# EAGLE schematic EEZ DIB AFE1 r1B5 (EAGLE 7.2.0)
2 x Hi-voltage, 2 x Hi-current
Assembly variants: Farnell, TME

## Sheet 1 of 5: AFE Ch#1 (Hi-voltage)
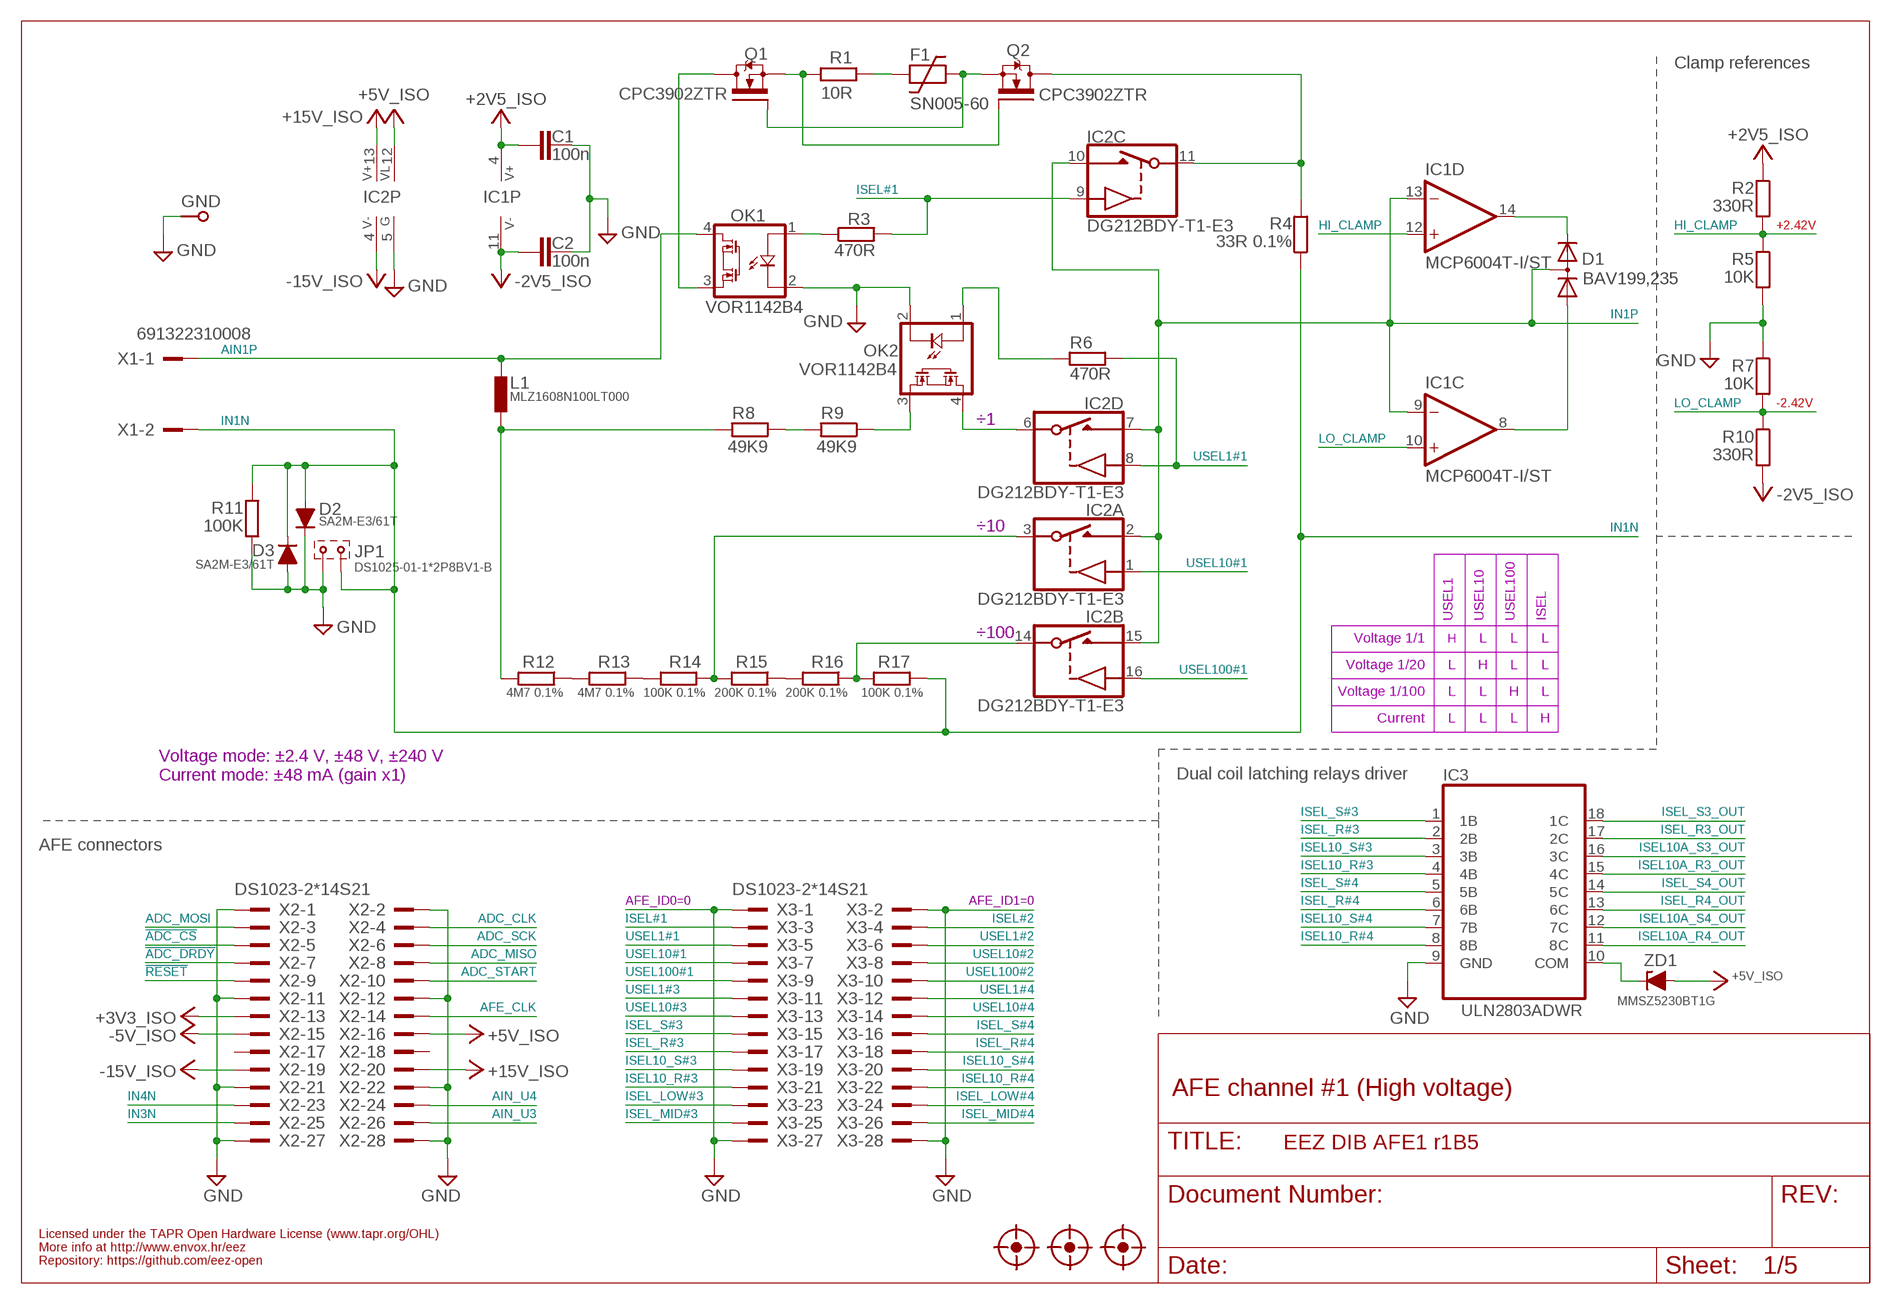
[diagram p0: schematic, sheet 1]

### Parts
C1  100n  C-EUC0603  [C0603]
C2  100n  C-EUC0603  [C0603]
D1  BAV199,235  BAV199  [SOT23]
D2  SA2M-E3/61T  DIODE_SMA-NARROW  [SMA_NARROW]
D3  SA2M-E3/61T  DIODE_SMA-NARROW  [SMA_NARROW]
F1  SN005-60  FUSE_RESETTABLE2  [C1206-HV]
FM1  FIDUCIAL_2  [FIDUCIAL_DUAL]
FM2  FIDUCIAL_2  [FIDUCIAL_DUAL]
FM3  FIDUCIAL_2  [FIDUCIAL_DUAL]
GND  PCB_TEST_TABSHIELD  [PCB_SHIELD_TAB]
IC1  MCP6004T-I/ST  OPA4197PW  [PW(R-PDSO-G14)]
IC2  DG212BDY-T1-E3  [SO16]
IC3  ULN2803ADWR  [DW18_TEX-M]
JP1  DS1025-01-1*2P8BV1-B  JUMPER-2PIN-2MM  [2MM-2]
L1  MLZ1608N100LT000  FERRITE_BEAD0603  [BEAD0603]
OK1  VOR1142B4  [DIL4-SMD]
OK2  VOR1142B4  [DIL4-SMD]
Q1  CPC3902ZTR  BSP129SOT-223  [SOT230P700X180-4N]
Q2  CPC3902ZTR  BSP129SOT-223  [SOT230P700X180-4N]
R1  10R  R-EU_R0805  [R0805]
R2  330R  R-EU_R0805  [R0805]
R3  470R  R-EU_R0805  [R0805]
R4  33R 0.1%  R-EU_R1206  [R1206]
R5  10K  R-EU_R0805  [R0805]
R6  470R  R-EU_R0805  [R0805]
R7  10K  R-EU_R0805  [R0805]
R8  49K9  R-EU_R1206  [R1206]
R9  49K9  R-EU_R1206  [R1206]
R10  330R  R-EU_R0805  [R0805]
R11  100K  R-EU_R1206  [R1206]
R12  4M7 0.1%  R-EU_R1206  [R1206]
R13  4M7 0.1%  R-EU_R1206  [R1206]
R14  100K 0.1%  R-EU_R1206  [R1206]
R15  200K 0.1%  R-EU_R1206  [R1206]
R16  200K 0.1%  R-EU_R1206  [R1206]
R17  100K 0.1%  R-EU_R1206  [R1206]
X1  691322310008  [691322310008]
X2  DS1023-2*14S21  TSW-114-07-F-D  [TSW-114-07-F-D]
X3  DS1023-2*14S21  TSW-114-07-F-D  [TSW-114-07-F-D]
ZD1  MMSZ5230BT1G  ZENER-DIODESOD123  [SOD123]

### Nets
!ADC_CS: X2.5 ; also sheet 5
!ADC_DRDY: X2.7 ; also sheet 5
!RESET: X2.9 ; also sheet 5
+2V5_ISO: C1.2 IC1.4(P:V+) R2.1 ; also sheet 3,4,5
+3V3_ISO: X2.13 ; also sheet 5
+5V_ISO: IC2.12(P:VL) X2.16 ZD1.A ; also sheet 2,3,4,5
+15V_ISO: IC2.13(P:V+) X2.20 ; also sheet 2,3,4
-2V5_ISO: C2.2 IC1.11(P:V-) R10.2 ; also sheet 3,4,5
-5V_ISO: X2.15 ; also sheet 5
-15V_ISO: IC2.4(P:V-) X2.19 ; also sheet 2,3,4
ADC_CLK: X2.4 ; also sheet 5
ADC_MISO: X2.8 ; also sheet 5
ADC_MOSI: X2.3 ; also sheet 5
ADC_SCK: X2.6 ; also sheet 5
ADC_START: X2.10 ; also sheet 5
AFE_CLK: X2.14
AIN1P: L1.P$2 OK1.4(S1) X1.1
AIN_U3: X2.26 ; also sheet 3
AIN_U4: X2.24 ; also sheet 4
CURR#1: IC2.11(C:S) Q2.2(D) Q2.4(D) R4.2
CURR_IN#1: OK1.3(S2) Q1.2(D) Q1.4(D)
GND: C1.1 C2.1 D2.1(C) D3.2(A) GND.1 IC2.5(P:GND) IC3.9(GND) JP1.2 OK1.2(C) OK2.2(C) R5.2 R7.1 R11.1 X2.1 X2.2 X2.11 X2.12 X2.21 X2.22 X2.27 X2.28 X3.1 X3.2 X3.27 X3.28 ; also sheet 2,3,4,5
HI_CLAMP: IC1.12(D:+IN) R2.2 R5.1 ; also sheet 2,3,4
IN1N: D2.2(A) D3.1(C) JP1.1 R4.1 R11.2 R17.1 X1.2 ; also sheet 5
IN1P: D1.3(AC) IC1.9(C:-IN) IC1.13(D:-IN) IC2.2(A:D) IC2.7(D:D) IC2.10(C:D) IC2.15(B:D) ; also sheet 5
IN3N: X2.25 ; also sheet 3,5
IN4N: X2.23 ; also sheet 4,5
ISEL10_R#3: IC3.4(4B) X3.21
ISEL10_R#4: IC3.8(8B) X3.22
ISEL10_S#3: IC3.3(3B) X3.19
ISEL10_S#4: IC3.7(7B) X3.20
ISEL10A_R3_OUT: IC3.15(4C) ; also sheet 3
ISEL10A_R4_OUT: IC3.11(8C) ; also sheet 4
ISEL10A_S3_OUT: IC3.16(3C) ; also sheet 3
ISEL10A_S4_OUT: IC3.12(7C) ; also sheet 4
ISEL#1: IC2.9(C:IN) R3.2 X3.3
ISEL#2: X3.4 ; also sheet 2
ISEL_LOW#3: X3.23 ; also sheet 3
ISEL_LOW#4: X3.24 ; also sheet 4
ISEL_MID#3: X3.25 ; also sheet 3
ISEL_MID#4: X3.26 ; also sheet 4
ISEL_R3_OUT: IC3.17(2C) ; also sheet 3
ISEL_R4_OUT: IC3.13(6C) ; also sheet 4
ISEL_R#3: IC3.2(2B) X3.17
ISEL_R#4: IC3.6(6B) X3.18
ISEL_S3_OUT: IC3.18(1C) ; also sheet 3
ISEL_S4_OUT: IC3.14(5C) ; also sheet 4
ISEL_S#3: IC3.1(1B) X3.15
ISEL_S#4: IC3.5(5B) X3.16
LO_CLAMP: IC1.10(C:+IN) R7.2 R10.1 ; also sheet 2,3,4
N$6: L1.P$1 R8.2 R12.2
N$44: OK2.1(A) R6.2
N$78: F1.2 Q1.1(G) Q2.3(S)
N$86: Q1.3(S) Q2.1(G) R1.2
N$128: R15.1 R16.2
N$137: IC3.10(COM) ZD1.C
N$139: OK1.1(A) R3.1
N$156: R13.1 R14.2
N$157: R12.1 R13.2
N$158: IC2.14(B:S) R16.1 R17.2
N$165: IC2.6(D:S) OK2.4(S1)
N$166: OK2.3(S2) R9.1
N$172: F1.1 R1.1
N$180: D1.2(C) IC1.14(D:OUT)
N$181: D1.1(A) IC1.8(C:OUT)
N$186: R8.1 R9.2
N$188: IC2.3(A:S) R14.1 R15.2
USEL1#1: IC2.8(D:IN) R6.1 X3.5
USEL1#2: X3.6 ; also sheet 2
USEL1#3: X3.11 ; also sheet 3
USEL1#4: X3.12 ; also sheet 4
USEL10#1: IC2.1(A:IN) X3.7
USEL10#2: X3.8 ; also sheet 2
USEL10#3: X3.13 ; also sheet 3
USEL10#4: X3.14 ; also sheet 4
USEL100#1: IC2.16(B:IN) X3.9
USEL100#2: X3.10 ; also sheet 2
Unconnected: X2.17 X2.18

### Notes on the sheet
- Clamp references
- +2.42V
- -2.42V
- ÷1
- ÷10
- USEL1 | USEL10 | USEL100 | ISEL
- ÷100
- Voltage 1/1 | H | L | L | L
- Voltage 1/20 | L | H | L | L
- Voltage 1/100 | L | L | H | L
- Current | L | L | L | H
- Dual coil latching relays driver
- Voltage mode: ±2.4 V, ±48 V, ±240 V
  Current mode: ±48 mA (gain x1)
- AFE connectors
- AFE_ID0=0 | AFE_ID1=0
- AFE channel #1 (High voltage)
- Licensed under the TAPR Open Hardware License (www.tapr.org/OHL)
- More info at http://www.envox.hr/eez
- Repository: https://github.com/eez-open

## Sheet 2 of 5: AFE Ch#2 (Hi-voltage)
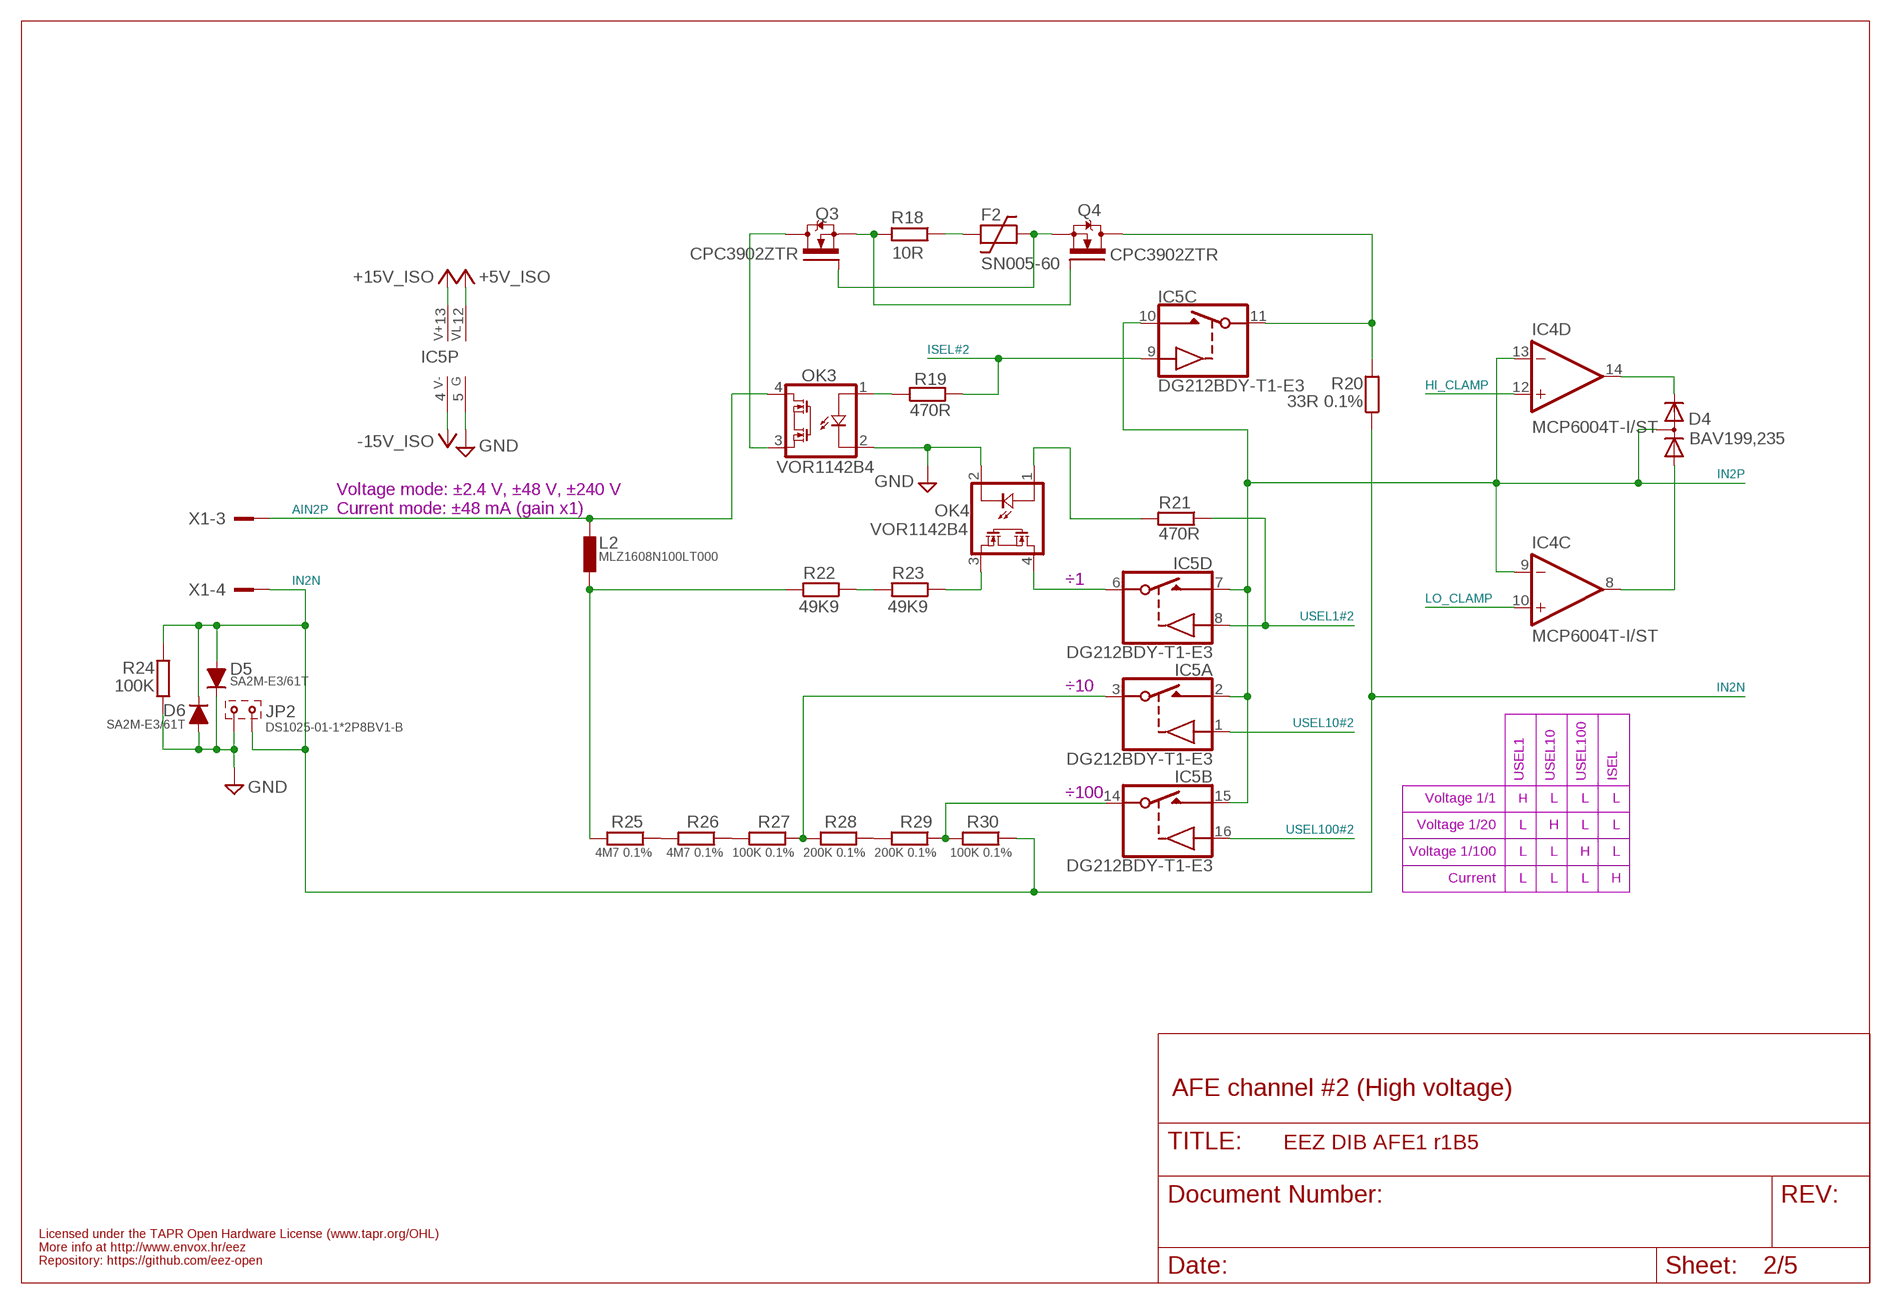
[diagram p1: schematic, sheet 2]

### Parts
D4  BAV199,235  BAV199  [SOT23]
D5  SA2M-E3/61T  DIODE_SMA-NARROW  [SMA_NARROW]
D6  SA2M-E3/61T  DIODE_SMA-NARROW  [SMA_NARROW]
F2  SN005-60  FUSE_RESETTABLE2  [C1206-HV]
IC4  MCP6004T-I/ST  OPA4197PW  [PW(R-PDSO-G14)]
IC5  DG212BDY-T1-E3  [SO16]
JP2  DS1025-01-1*2P8BV1-B  JUMPER-2PIN-2MM  [2MM-2]
L2  MLZ1608N100LT000  FERRITE_BEAD0603  [BEAD0603]
OK3  VOR1142B4  [DIL4-SMD]
OK4  VOR1142B4  [DIL4-SMD]
Q3  CPC3902ZTR  BSP129SOT-223  [SOT230P700X180-4N]
Q4  CPC3902ZTR  BSP129SOT-223  [SOT230P700X180-4N]
R18  10R  R-EU_R0805  [R0805]
R19  470R  R-EU_R0805  [R0805]
R20  33R 0.1%  R-EU_R1206  [R1206]
R21  470R  R-EU_R0805  [R0805]
R22  49K9  R-EU_R1206  [R1206]
R23  49K9  R-EU_R1206  [R1206]
R24  100K  R-EU_R1206  [R1206]
R25  4M7 0.1%  R-EU_R1206  [R1206]
R26  4M7 0.1%  R-EU_R1206  [R1206]
R27  100K 0.1%  R-EU_R1206  [R1206]
R28  200K 0.1%  R-EU_R1206  [R1206]
R29  200K 0.1%  R-EU_R1206  [R1206]
R30  100K 0.1%  R-EU_R1206  [R1206]

### Nets
+5V_ISO: IC5.12(P:VL) ; also sheet 1,3,4,5
+15V_ISO: IC5.13(P:V+) ; also sheet 1,3,4
-15V_ISO: IC5.4(P:V-) ; also sheet 1,3,4
AIN2P: L2.P$2 OK3.4(S1) X1.3
CURR#2: IC5.11(C:S) Q4.2(D) Q4.4(D) R20.2
CURR_IN#2: OK3.3(S2) Q3.2(D) Q3.4(D)
GND: D5.1(C) D6.2(A) IC5.5(P:GND) JP2.2 OK3.2(C) OK4.2(C) R24.1 ; also sheet 1,3,4,5
HI_CLAMP: IC4.12(D:+IN) ; also sheet 1,3,4
IN2N: D5.2(A) D6.1(C) JP2.1 R20.1 R24.2 R30.1 X1.4 ; also sheet 5
IN2P: D4.3(AC) IC4.9(C:-IN) IC4.13(D:-IN) IC5.2(A:D) IC5.7(D:D) IC5.10(C:D) IC5.15(B:D) ; also sheet 5
ISEL#2: IC5.9(C:IN) R19.2 ; also sheet 1
LO_CLAMP: IC4.10(C:+IN) ; also sheet 1,3,4
N$13: L2.P$1 R22.2 R25.2
N$56: IC5.14(B:S) R29.1 R30.2
N$57: IC5.6(D:S) OK4.4(S1)
N$58: OK4.3(S2) R23.1
N$59: D4.2(C) IC4.14(D:OUT)
N$60: D4.1(A) IC4.8(C:OUT)
N$61: R22.1 R23.2
N$62: IC5.3(A:S) R27.1 R28.2
N$63: R28.1 R29.2
N$64: R26.1 R27.2
N$65: R25.1 R26.2
N$66: OK3.1(A) R19.1
N$67: OK4.1(A) R21.2
N$68: F2.2 Q3.1(G) Q4.3(S)
N$69: Q3.3(S) Q4.1(G) R18.2
N$72: F2.1 R18.1
USEL1#2: IC5.8(D:IN) R21.1 ; also sheet 1
USEL10#2: IC5.1(A:IN) ; also sheet 1
USEL100#2: IC5.16(B:IN) ; also sheet 1

### Notes on the sheet
- Voltage mode: ±2.4 V, ±48 V, ±240 V
  Current mode: ±48 mA (gain x1)
- ÷1
- ÷10
- USEL1 | USEL10 | USEL100 | ISEL
- ÷100
- Voltage 1/1 | H | L | L | L
- Voltage 1/20 | L | H | L | L
- Voltage 1/100 | L | L | H | L
- Current | L | L | L | H
- AFE channel #2 (High voltage)
- Licensed under the TAPR Open Hardware License (www.tapr.org/OHL)
- More info at http://www.envox.hr/eez
- Repository: https://github.com/eez-open

## Sheet 3 of 5: AFE Ch#3 (Hi-current)
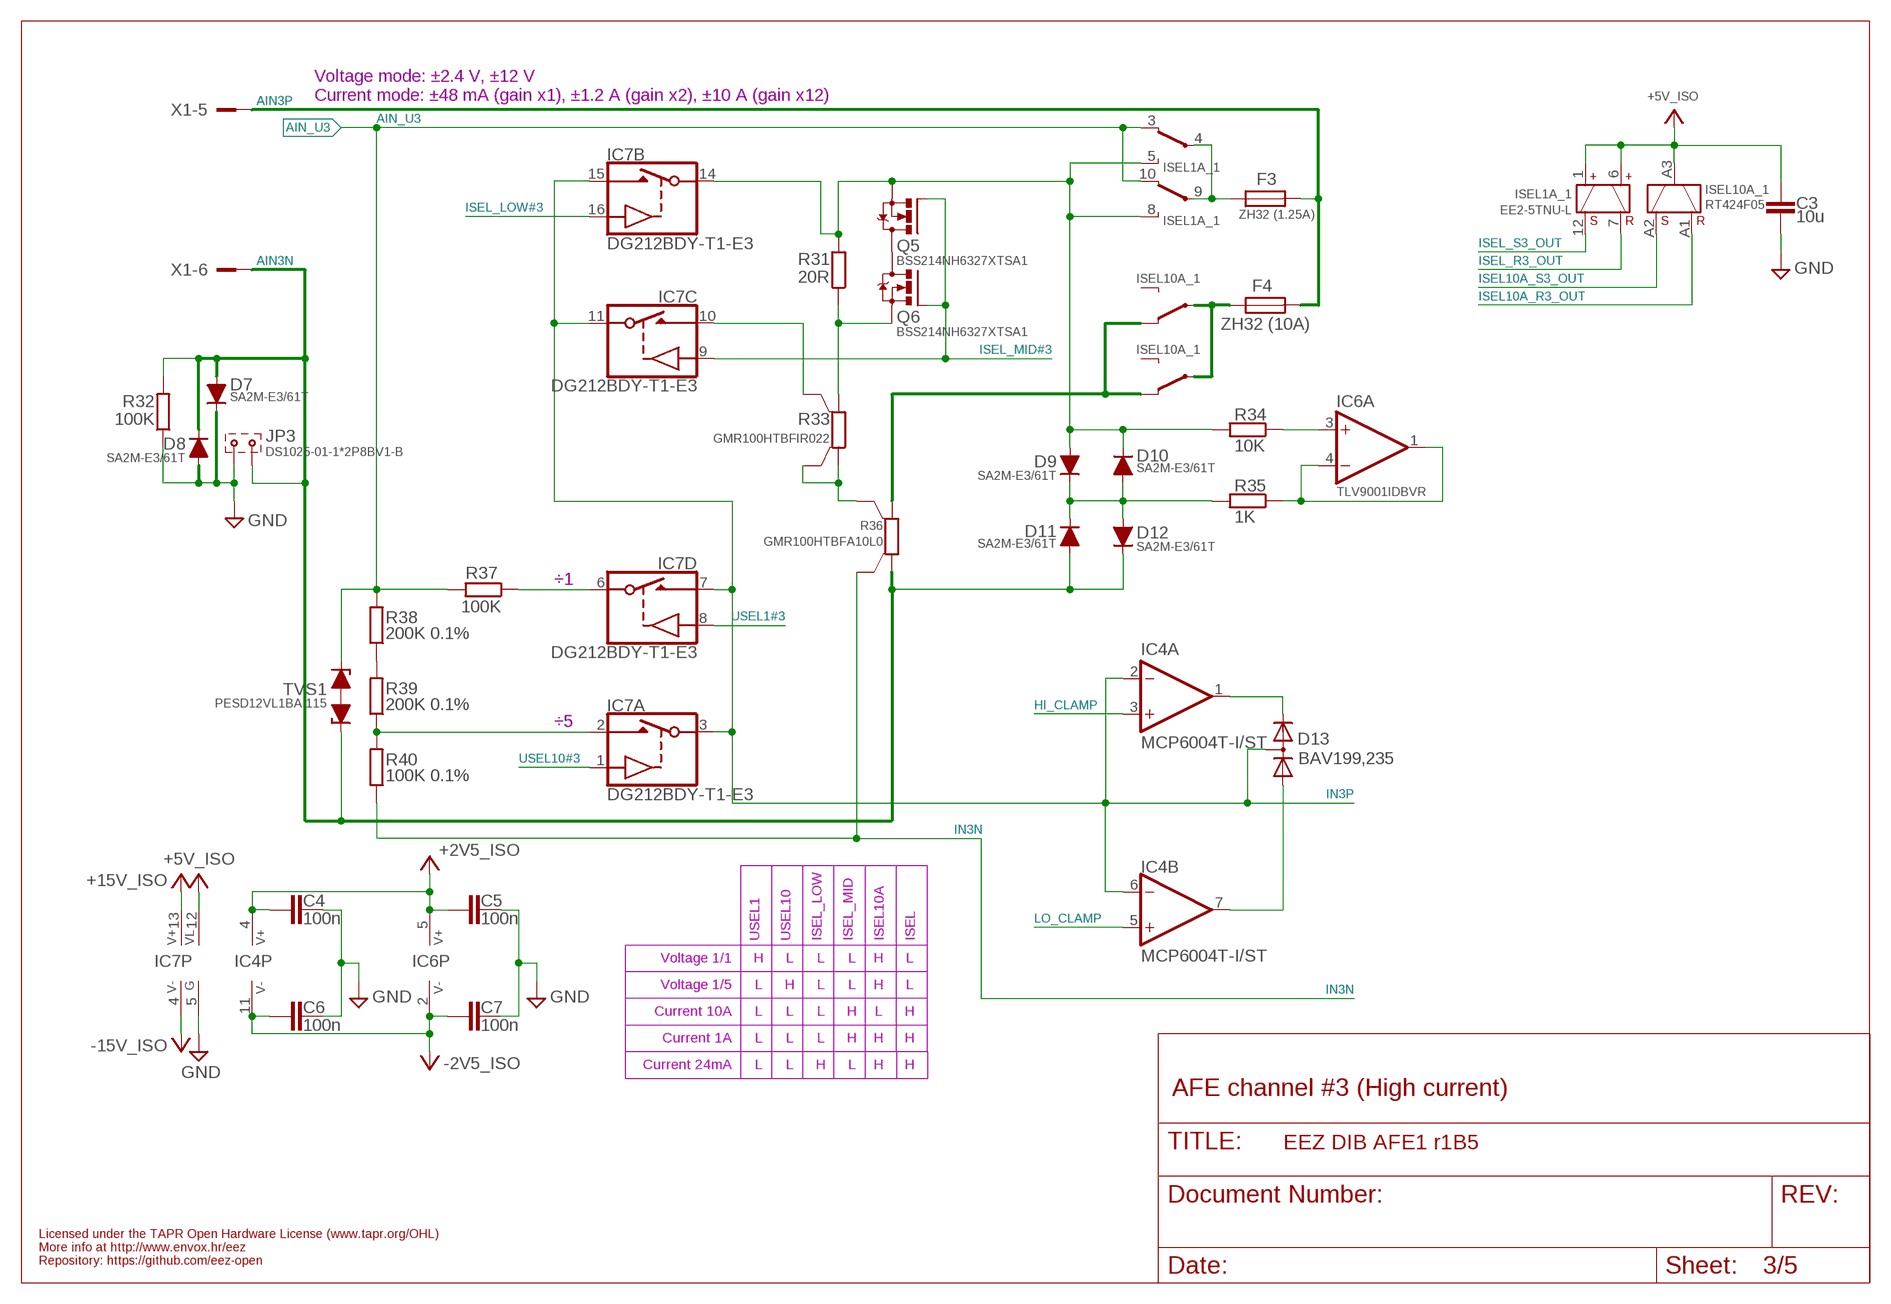
[diagram p2: schematic, sheet 3]

### Parts
C3  10u  C-EUC1206  [C1206]
C4  100n  C-EUC0603  [C0603]
C5  100n  C-EUC0603  [C0603]
C6  100n  C-EUC0603  [C0603]
C7  100n  C-EUC0603  [C0603]
D7  SA2M-E3/61T  DIODE_SMA-NARROW  [SMA_NARROW]
D8  SA2M-E3/61T  DIODE_SMA-NARROW  [SMA_NARROW]
D9  SA2M-E3/61T  DIODE_SMA-NARROW  [SMA_NARROW]
D10  SA2M-E3/61T  DIODE_SMA-NARROW  [SMA_NARROW]
D11  SA2M-E3/61T  DIODE_SMA-NARROW  [SMA_NARROW]
D12  SA2M-E3/61T  DIODE_SMA-NARROW  [SMA_NARROW]
D13  BAV199,235  BAV199  [SOT23]
F3  ZH32 (1.25A)  ZH32  [ZH32]
F4  ZH32 (10A)  ZH32  [ZH32]
IC6  TLV9001IDBVR  OPA376AIDBVR  [DBV5]
IC7  DG212BDY-T1-E3  [SO16]
ISEL1A_1  EE2-5TNU-L  G6SK-2F  [G6SK-2F]
ISEL10A_1  RT424F05  RT424FXX  [RT424FXX]
JP3  DS1025-01-1*2P8BV1-B  JUMPER-2PIN-2MM  [2MM-2]
Q5  BSS214NH6327XTSA1  2N7002  [SOT103P240X110-3N]
Q6  BSS214NH6327XTSA1  2N7002  [SOT103P240X110-3N]
R31  20R  R-EU_R1206  [R1206]
R32  100K  R-EU_R1206  [R1206]
R33  GMR100HTBFIR022  R-EU_4WIRE2512  [R_2512-4WIRE]
R34  10K  R-EU_R0805  [R0805]
R35  1K  R-EU_R0805  [R0805]
R36  GMR100HTBFA10L0  R-EU_4WIRE2512  [R_2512-4WIRE]
R37  100K  R-EU_R1206  [R1206]
R38  200K 0.1%  R-EU_R1206  [R1206]
R39  200K 0.1%  R-EU_R1206  [R1206]
R40  100K 0.1%  R-EU_R1206  [R1206]
TVS1  PESD12VL1BA,115  PESDXL1BA  [SOD323-BIDIR]

### Nets
+2V5_ISO: C4.2 C5.2 IC4.4(P:V+) IC6.5(P:V+) ; also sheet 1,4,5
+5V_ISO: C3.1 IC7.12(P:VL) ISEL1A_1.1(A:S+) ISEL1A_1.6(A:R+) ISEL10A_1.A3(A:COM) ; also sheet 1,2,4,5
+15V_ISO: IC7.13(P:V+) ; also sheet 1,2,4
-2V5_ISO: C6.2 C7.2 IC4.11(P:V-) IC6.2(P:V-) ; also sheet 1,4,5
-15V_ISO: IC7.4(P:V-) ; also sheet 1,2,4
AIN3N: D7.2(A) D8.1(C) D11.2(A) D12.1(C) JP3.1 R32.2 R36.1 TVS1.C1 X1.6
AIN3P: F3.2 F4.2 X1.5
AIN3P_FUSED: F3.1 ISEL1A_1.4(B:COM) ISEL1A_1.9(C:COM)
AIN_U3: ISEL1A_1.3(B:NC) ISEL1A_1.10(C:NC) R37.2 R38.2 TVS1.C2 ; also sheet 1
GND: C3.2 C4.1 C5.1 C6.1 C7.1 D7.1(C) D8.2(A) IC7.5(P:GND) JP3.2 R32.1 ; also sheet 1,2,4,5
HI_CLAMP: IC4.3(A:+IN) ; also sheet 1,2,4
HI_CURR#2: ISEL10A_1.12(B:NC) ISEL10A_1.22(C:NC) R36.2
IN3N: R36.1S R40.1 ; also sheet 1,5
IN3P: D13.3(AC) IC4.2(A:-IN) IC4.6(B:-IN) IC7.3(A:S) IC7.7(D:D) IC7.11(C:S) IC7.15(B:D) ; also sheet 5
ISEL10A_R3_OUT: ISEL10A_1.A1(A:R) ; also sheet 1
ISEL10A_S3_OUT: ISEL10A_1.A2(A:S) ; also sheet 1
ISEL_LOW#3: IC7.16(B:IN) ; also sheet 1
ISEL_MID#3: IC7.9(C:IN) Q5.1(G) Q6.1(G) ; also sheet 1
ISEL_R3_OUT: ISEL1A_1.7(A:R-) ; also sheet 1
ISEL_S3_OUT: ISEL1A_1.12(A:S-) ; also sheet 1
LO_CLAMP: IC4.5(B:+IN) ; also sheet 1,2,4
N$30: F4.1 ISEL10A_1.11(B:COM) ISEL10A_1.21(C:COM)
N$31: R33.1 R33.1S R36.2S
N$55: Q6.2(S) R31.1 R33.2
N$81: Q5.3(D) Q6.3(D)
N$170: IC7.10(C:D) R33.2S
N$173: D9.1(C) D10.2(A) D11.1(C) D12.2(A) R35.2
N$182: D9.2(A) D10.1(C) IC7.14(B:S) ISEL1A_1.5(B:NO) ISEL1A_1.8(C:NO) Q5.2(S) R31.2 R34.2
N$183: IC6.1(A:OUT) IC6.4(A:-IN) R35.1
N$184: IC6.3(A:+IN) R34.1
N$187: R38.1 R39.2
N$189: IC7.2(A:D) R39.1 R40.2
N$192: IC7.6(D:S) R37.1
N$199: D13.2(C) IC4.1(A:OUT)
N$200: D13.1(A) IC4.7(B:OUT)
USEL1#3: IC7.8(D:IN) ; also sheet 1
USEL10#3: IC7.1(A:IN) ; also sheet 1
Unconnected: ISEL10A_1.14(B:NO) ISEL10A_1.24(C:NO)

### Notes on the sheet
- Voltage mode: ±2.4 V, ±12 V
  Current mode: ±48 mA (gain x1), ±1.2 A (gain x2), ±10 A (gain x12)
- ÷1
- ÷5
- USEL1 | USEL10 | ISEL_LOW | ISEL_MID | ISEL10A | ISEL
- Voltage 1/1 | H | L | L | L | H | L
- Voltage 1/5 | L | H | L | L | H | L
- Current 10A | L | L | L | H | L | H
- Current 1A | L | L | L | H | H | H
- Current 24mA | L | L | H | L | H | H
- AFE channel #3 (High current)
- Licensed under the TAPR Open Hardware License (www.tapr.org/OHL)
- More info at http://www.envox.hr/eez
- Repository: https://github.com/eez-open

## Sheet 4 of 5: AFE Ch#4 (Hi-current)
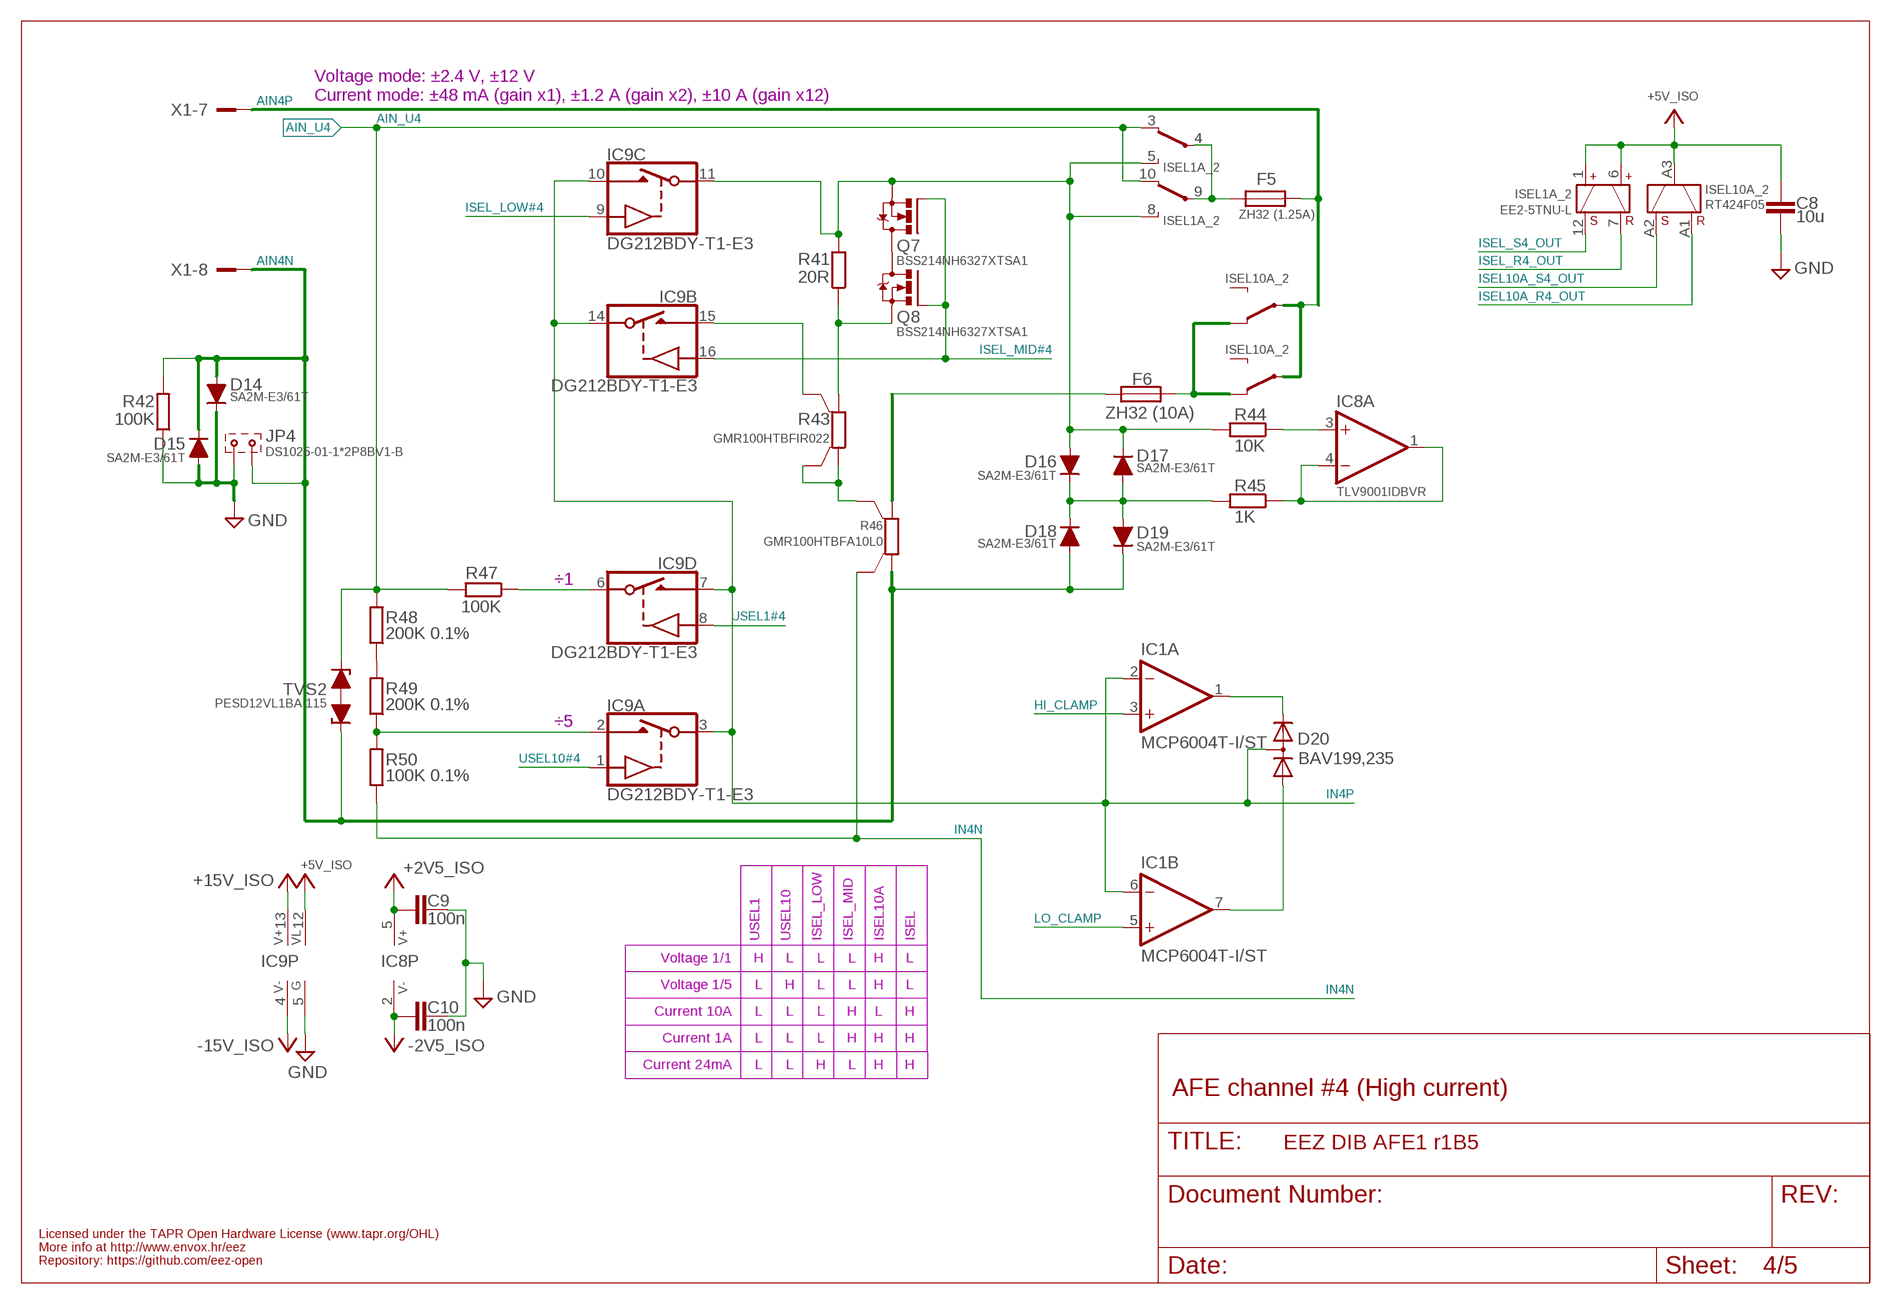
[diagram p3: schematic, sheet 4]

### Parts
C8  10u  C-EUC1206  [C1206]
C9  100n  C-EUC0603  [C0603]
C10  100n  C-EUC0603  [C0603]
D14  SA2M-E3/61T  DIODE_SMA-NARROW  [SMA_NARROW]
D15  SA2M-E3/61T  DIODE_SMA-NARROW  [SMA_NARROW]
D16  SA2M-E3/61T  DIODE_SMA-NARROW  [SMA_NARROW]
D17  SA2M-E3/61T  DIODE_SMA-NARROW  [SMA_NARROW]
D18  SA2M-E3/61T  DIODE_SMA-NARROW  [SMA_NARROW]
D19  SA2M-E3/61T  DIODE_SMA-NARROW  [SMA_NARROW]
D20  BAV199,235  BAV199  [SOT23]
F5  ZH32 (1.25A)  ZH32  [ZH32]
F6  ZH32 (10A)  ZH32  [ZH32]
IC8  TLV9001IDBVR  OPA376AIDBVR  [DBV5]
IC9  DG212BDY-T1-E3  [SO16]
ISEL1A_2  EE2-5TNU-L  G6SK-2F  [G6SK-2F]
ISEL10A_2  RT424F05  RT424FXX  [RT424FXX]
JP4  DS1025-01-1*2P8BV1-B  JUMPER-2PIN-2MM  [2MM-2]
Q7  BSS214NH6327XTSA1  2N7002  [SOT103P240X110-3N]
Q8  BSS214NH6327XTSA1  2N7002  [SOT103P240X110-3N]
R41  20R  R-EU_R1206  [R1206]
R42  100K  R-EU_R1206  [R1206]
R43  GMR100HTBFIR022  R-EU_4WIRE2512  [R_2512-4WIRE]
R44  10K  R-EU_R0805  [R0805]
R45  1K  R-EU_R0805  [R0805]
R46  GMR100HTBFA10L0  R-EU_4WIRE2512  [R_2512-4WIRE]
R47  100K  R-EU_R1206  [R1206]
R48  200K 0.1%  R-EU_R1206  [R1206]
R49  200K 0.1%  R-EU_R1206  [R1206]
R50  100K 0.1%  R-EU_R1206  [R1206]
TVS2  PESD12VL1BA,115  PESDXL1BA  [SOD323-BIDIR]

### Nets
+2V5_ISO: C9.2 IC8.5(P:V+) ; also sheet 1,3,5
+5V_ISO: C8.1 IC9.12(P:VL) ISEL1A_2.1(A:S+) ISEL1A_2.6(A:R+) ISEL10A_2.A3(A:COM) ; also sheet 1,2,3,5
+15V_ISO: IC9.13(P:V+) ; also sheet 1,2,3
-2V5_ISO: C10.2 IC8.2(P:V-) ; also sheet 1,3,5
-15V_ISO: IC9.4(P:V-) ; also sheet 1,2,3
AIN4N: D14.2(A) D15.1(C) D18.2(A) D19.1(C) JP4.1 R42.2 R46.1 TVS2.C1 X1.8
AIN4P: F5.2 ISEL10A_2.11(B:COM) ISEL10A_2.21(C:COM) X1.7
AIN4P_FUSED: F5.1 ISEL1A_2.4(B:COM) ISEL1A_2.9(C:COM)
AIN_U4: ISEL1A_2.3(B:NC) ISEL1A_2.10(C:NC) R47.2 R48.2 TVS2.C2 ; also sheet 1
GND: C8.2 C9.1 C10.1 D14.1(C) D15.2(A) IC9.5(P:GND) JP4.2 R42.1 ; also sheet 1,2,3,5
HI_CLAMP: IC1.3(A:+IN) ; also sheet 1,2,3
HI_CURR#4: F6.2 R46.2
IN4N: R46.1S R50.1 ; also sheet 1,5
IN4P: D20.3(AC) IC1.2(A:-IN) IC1.6(B:-IN) IC9.3(A:S) IC9.7(D:D) IC9.10(C:D) IC9.14(B:S) ; also sheet 5
ISEL10A_R4_OUT: ISEL10A_2.A1(A:R) ; also sheet 1
ISEL10A_S4_OUT: ISEL10A_2.A2(A:S) ; also sheet 1
ISEL_LOW#4: IC9.9(C:IN) ; also sheet 1
ISEL_MID#4: IC9.16(B:IN) Q7.1(G) Q8.1(G) ; also sheet 1
ISEL_R4_OUT: ISEL1A_2.7(A:R-) ; also sheet 1
ISEL_S4_OUT: ISEL1A_2.12(A:S-) ; also sheet 1
LO_CLAMP: IC1.5(B:+IN) ; also sheet 1,2,3
N$2: F6.1 ISEL10A_2.12(B:NC) ISEL10A_2.22(C:NC)
N$15: Q8.2(S) R41.1 R43.2
N$16: D16.1(C) D17.2(A) D18.1(C) D19.2(A) R45.2
N$17: D16.2(A) D17.1(C) IC9.11(C:S) ISEL1A_2.5(B:NO) ISEL1A_2.8(C:NO) Q7.2(S) R41.2 R44.2
N$18: IC8.1(A:OUT) IC8.4(A:-IN) R45.1
N$19: IC8.3(A:+IN) R44.1
N$20: R48.1 R49.2
N$21: IC9.2(A:D) R49.1 R50.2
N$25: IC9.6(D:S) R47.1
N$28: D20.2(C) IC1.1(A:OUT)
N$29: D20.1(A) IC1.7(B:OUT)
N$32: IC9.15(B:D) R43.2S
N$33: Q7.3(D) Q8.3(D)
N$37: R43.1 R43.1S R46.2S
USEL1#4: IC9.8(D:IN) ; also sheet 1
USEL10#4: IC9.1(A:IN) ; also sheet 1
Unconnected: ISEL10A_2.14(B:NO) ISEL10A_2.24(C:NO)

### Notes on the sheet
- Voltage mode: ±2.4 V, ±12 V
  Current mode: ±48 mA (gain x1), ±1.2 A (gain x2), ±10 A (gain x12)
- ÷1
- ÷5
- USEL1 | USEL10 | ISEL_LOW | ISEL_MID | ISEL10A | ISEL
- Voltage 1/1 | H | L | L | L | H | L
- Voltage 1/5 | L | H | L | L | H | L
- Current 10A | L | L | L | H | L | H
- Current 1A | L | L | L | H | H | H
- Current 24mA | L | L | H | L | H | H
- AFE channel #4 (High current)
- Licensed under the TAPR Open Hardware License (www.tapr.org/OHL)
- More info at http://www.envox.hr/eez
- Repository: https://github.com/eez-open

## Sheet 5 of 5: Voltage/current ADC
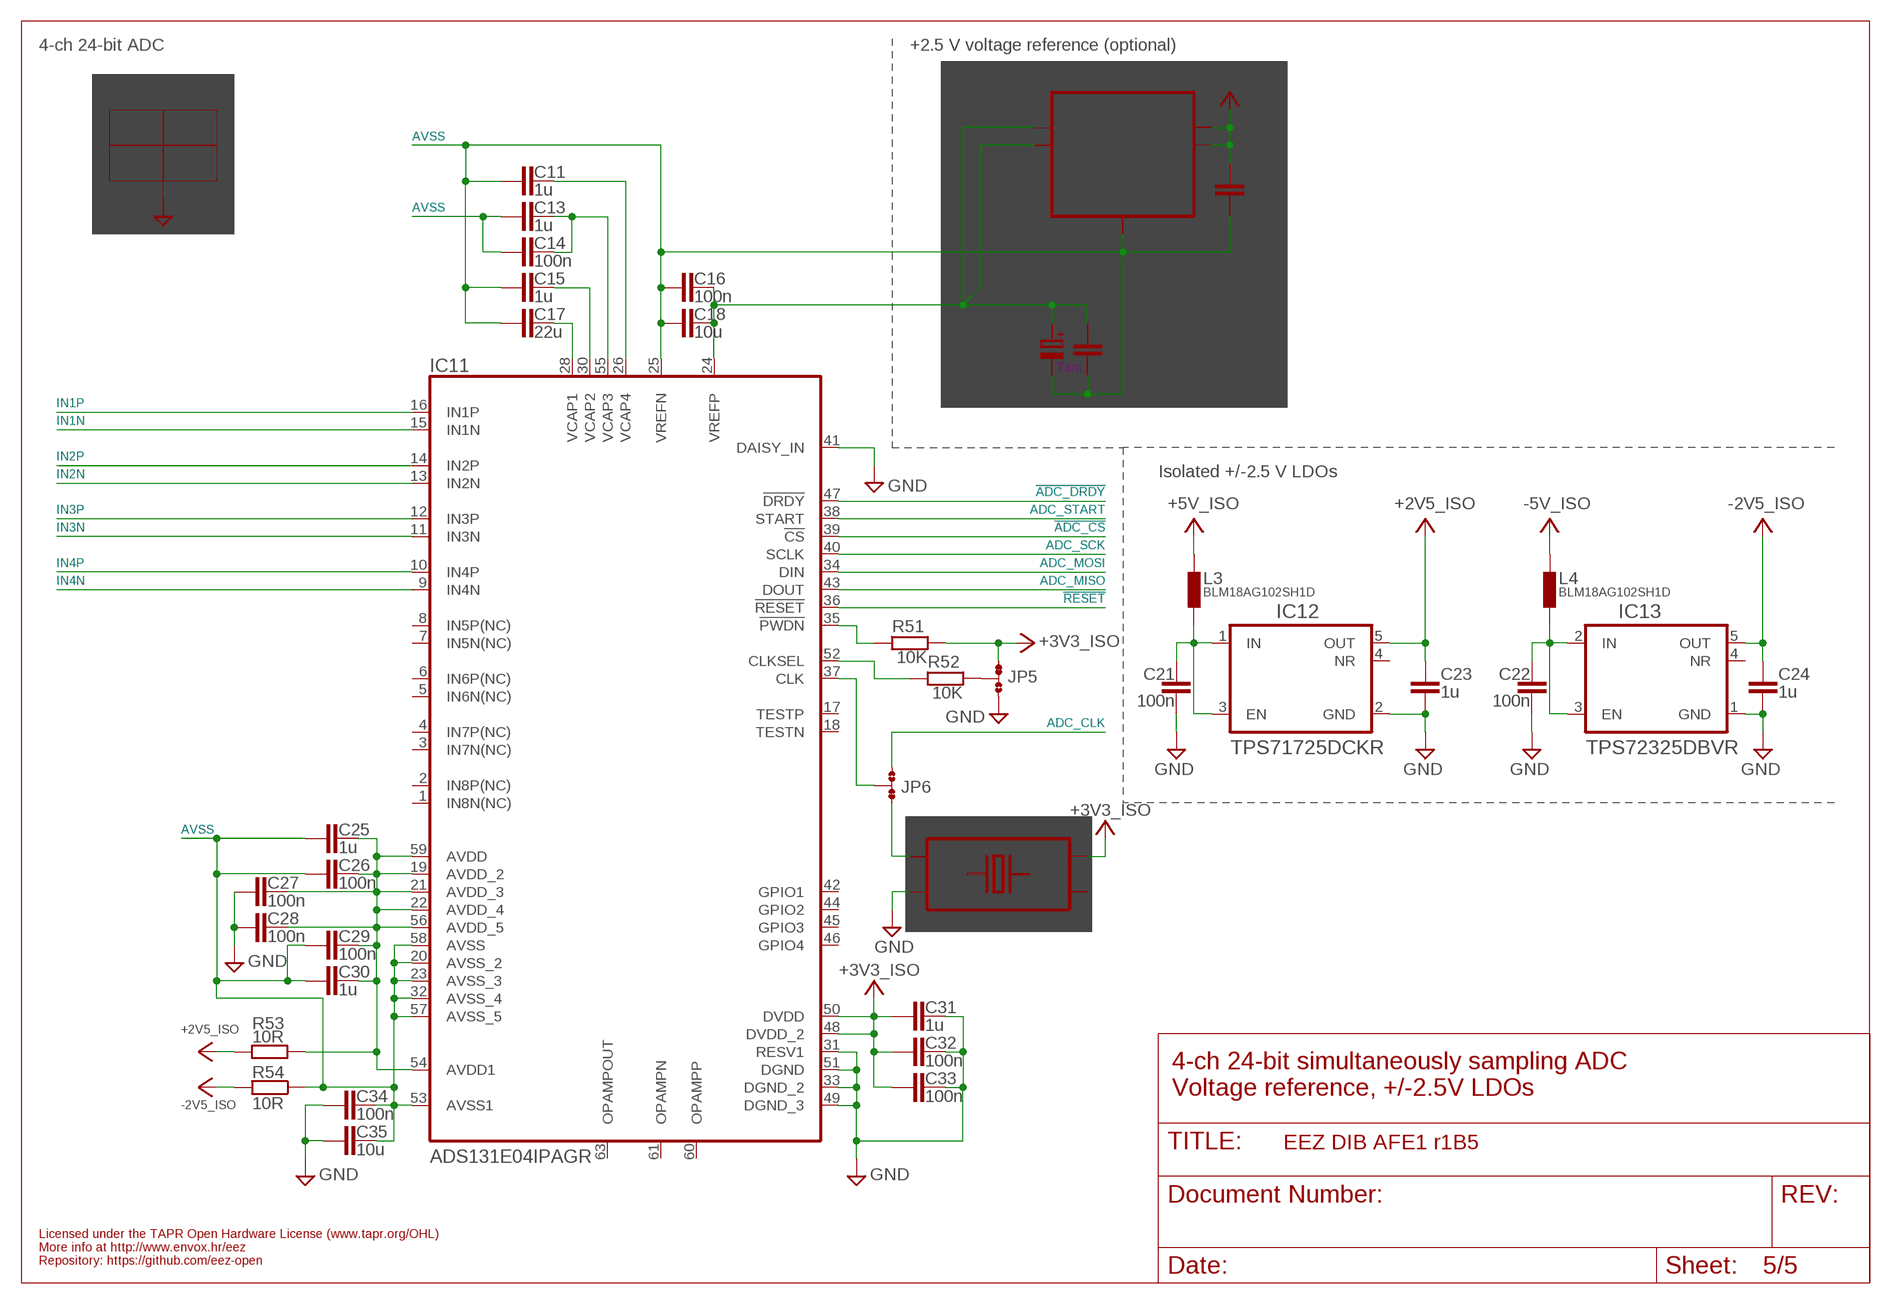
[diagram p4: schematic, sheet 5]

### Parts
C11  1u  C-EUC0805  [C0805]
C12  N.C.  C-EUC1206  [C1206]
C13  1u  C-EUC0805  [C0805]
C14  100n  C-EUC0603  [C0603]
C15  1u  C-EUC0805  [C0805]
C16  100n  C-EUC0603  [C0603]
C17  22u  C-EUC1206  [C1206]
C18  10u  C-EUC1206  [C1206]
C19  N.C.  ECAP1206  [EC1206]
C20  N.C.  C-EU7.5X11  [C050-075X110]
C21  100n  C-EUC0603  [C0603]
C22  100n  C-EUC0603  [C0603]
C23  1u  C-EUC0805  [C0805]
C24  1u  C-EUC0805  [C0805]
C25  1u  C-EUC0805  [C0805]
C26  100n  C-EUC0603  [C0603]
C27  100n  C-EUC0603  [C0603]
C28  100n  C-EUC0603  [C0603]
C29  100n  C-EUC0603  [C0603]
C30  1u  C-EUC0805  [C0805]
C31  1u  C-EUC0805  [C0805]
C32  100n  C-EUC0603  [C0603]
C33  100n  C-EUC0603  [C0603]
C34  100n  C-EUC0603  [C0603]
C35  10u  C-EUC1206  [C1206]
IC10  N.C.  LTC6655BHMS8  [MSOP-8_MS_LIT]
IC11  ADS131E04IPAGR  ADS131E0XIPAG  [PAG64]
IC12  TPS71725DCKR  [DCK5]
IC13  TPS72325DBVR  [DBV5]
JP5  JP3-CUT-0805-ROTATED  [JP3-0805-CUT2]
JP6  JP3-CUT-0805-ROTATED  [JP3-0805-CUT2]
L3  BLM18AG102SH1D  FERRITE_BEAD0603  [BEAD0603]
L4  BLM18AG102SH1D  FERRITE_BEAD0603  [BEAD0603]
R51  10K  R-EU_R0805  [R0805]
R52  10K  R-EU_R0805  [R0805]
R53  10R  R-EU_R0805  [R0805]
R54  10R  R-EU_R0805  [R0805]
S1  N.C.  2118732-2  [2118732-2]
XO1  N.C.  XLH  [XLH]

### Nets
!ADC_CS: IC11.39(!CS) ; also sheet 1
!ADC_DRDY: IC11.47(!DRDY) ; also sheet 1
!RESET: IC11.36(!RESET) ; also sheet 1
+2V5_ADC: C25.2 C26.1 C27.1 C28.1 C29.1 C30.2 IC11.19(AVDD_2) IC11.21(AVDD_3) IC11.22(AVDD_4) IC11.54(AVDD1) IC11.56(AVDD_5) IC11.59(AVDD) R53.2
+2V5_ISO: C23.2 IC12.5(OUT) R53.1 ; also sheet 1,3,4
+3V3_ISO: C31.1 C32.2 C33.2 IC11.48(DVDD_2) IC11.50(DVDD) JP5.NC R51.2 XO1.6(VDD) ; also sheet 1
+5V_ISO: C12.1 IC10.1(!SHDN) IC10.2(VIN) L3.P$2 ; also sheet 1,2,3,4
-2V5_ISO: C24.2 IC13.5(OUT) R54.2 ; also sheet 1,3,4
-5V_ISO: L4.P$2 ; also sheet 1
ADC_CLK: JP6.NO ; also sheet 1
ADC_MISO: IC11.43(DOUT) ; also sheet 1
ADC_MOSI: IC11.34(DIN) ; also sheet 1
ADC_SCK: IC11.40(SCLK) ; also sheet 1
ADC_START: IC11.38(START) ; also sheet 1
AVSS: C11.1 C12.2 C13.1 C14.2 C15.1 C16.2 C17.1 C18.2 C19.- C20.2 C25.1 C26.2 C29.2 C30.1 C34.1 C35.1 IC10.3(GND) IC10.4(GND) IC10.5(GND) IC10.8(GND) IC11.20(AVSS_2) IC11.23(AVSS_3) IC11.25(VREFN) IC11.32(AVSS_4) IC11.53(AVSS1) IC11.57(AVSS_5) IC11.58(AVSS) R54.1
GND: C21.2 C22.2 C23.1 C24.1 C27.2 C28.2 C31.2 C32.1 C33.1 C34.2 C35.2 IC11.31(RESV1) IC11.33(DGND_2) IC11.41(DAISY_IN) IC11.49(DGND_3) IC11.51(DGND) IC12.2(GND) IC13.1(GND) JP5.NO S1.SH.1(SH) S1.SH.2(SH) S1.SH.3(SH) S1.SH.4(SH) S1.SH.5(SH) S1.SH.6(SH) S1.SH.7(SH) S1.SH.8(SH) XO1.3(GND) ; also sheet 1,2,3,4
IN1N: IC11.15(IN1N) ; also sheet 1
IN1P: IC11.16(IN1P) ; also sheet 1
IN2N: IC11.13(IN2N) ; also sheet 2
IN2P: IC11.14(IN2P) ; also sheet 2
IN3N: IC11.11(IN3N) ; also sheet 1,3
IN3P: IC11.12(IN3P) ; also sheet 3
IN4N: IC11.9(IN4N) ; also sheet 1,4
IN4P: IC11.10(IN4P) ; also sheet 4
N$1: IC11.52(CLKSEL) R52.1
N$3: C21.1 IC12.1(IN) IC12.3(EN) L3.P$1
N$9: C22.1 IC13.2(IN) IC13.3(EN) L4.P$1
N$14: JP5.COM R52.2
N$92: C17.2 IC11.28(VCAP1)
N$93: C15.2 IC11.30(VCAP2)
N$94: C13.2 C14.1 IC11.55(VCAP3)
N$95: C11.2 IC11.26(VCAP4)
N$96: IC11.37(CLK) JP6.COM
N$97: JP6.NC XO1.4(OUT)
N$98: IC11.35(!PWDN) R51.1
VREFP: C16.1 C18.1 C19.+ C20.1 IC10.6(VOUT_S) IC10.7(VOUT_F) IC11.24(VREFP)
Unconnected: IC11.1(IN8N(NC)) IC11.2(IN8P(NC)) IC11.3(IN7N(NC)) IC11.4(IN7P(NC)) IC11.5(IN6N(NC)) IC11.6(IN6P(NC)) IC11.7(IN5N(NC)) IC11.8(IN5P(NC)) IC11.17(TESTP) IC11.18(TESTN) IC11.42(GPIO1) IC11.44(GPIO2) IC11.45(GPIO3) IC11.46(GPIO4) IC11.60(OPAMPP) IC11.61(OPAMPN) IC11.63(OPAMPOUT) IC12.4(NR) IC13.4(NR) XO1.1(EN)

### Notes on the sheet
- 4-ch 24-bit ADC | +2.5 V voltage reference (optional)
- Tant.
- Isolated +/-2.5 V LDOs
- 4-ch 24-bit simultaneously sampling ADC
  Voltage reference, +/-2.5V LDOs
- Licensed under the TAPR Open Hardware License (www.tapr.org/OHL)
- More info at http://www.envox.hr/eez
- Repository: https://github.com/eez-open

## Library data of the parts
C1-C18 C21-C35 = rcl:C-EU: CAPACITOR, European symbol
C19 = EEZ_Lib1:ECAP
C20 = EEZ_Lib1:C-EU
D1 D4 D13 D20 = diode:BAV199: DIODE low-leakage double diode
D2 D3 D5-D12 D14-D19 = EEZ_DIB:DIODE
F1 F2 = EEZ_Lib1:FUSE_RESETTABLE2
F3-F6 = EEZ_Lib1:ZH32: Fuse holder with cover; tube fuses; 5x20mm
FM1-FM3 = EEZ_Lib1:FIDUCIAL: Fiducial mark for pick and place automation
GND = EEZ_Lib1:PCB_TEST_TAB
IC1 IC4 = EEZ_TI:OPA4197: Precision, Rail-to-Rail Input/Output, Low Offset Voltage, Operational Amplifiers
IC2 IC5 IC7 IC9 = EEZ_DIB:DG212B: Improved Quad CMOS Analog Switches
IC3 = EEZ_TI:ULN2803A: 8 Darlington Transistor Array (500mA, 50V)
IC6 IC8 = EEZ_TI:OPA376A: Low-Noise, Low Quiescent Current, Precision Operational Amplifier
IC10 = EEZ_DIB:LTC6655: 0.25ppm Noise, Low Drift Precision References
IC11 = EEZ_TI:ADS131E0X: 16- / 24-bit up to 64-kSPS, 6-channel simultaneous-sampling delta-sigma ADC for power monitoring and protection
IC12 = EEZ_TI:TPS71725: Low-Noise, High-Bandwidth PSRR, Low-Dropout, 150-mA Linear Regulator
IC13 = EEZ_TI:TPS72325: 200mA Low-Noise, High-PSRR Negative Output Low-Dropout Linear Regulators
ISEL1A_1 ISEL1A_2 = EEZ_switches:G6SK-2F: Double-winding Latching double-pole signal switching Relay
ISEL10A_1 ISEL10A_2 = EEZ_switches:RT424FXX: Power PCB Relay RT2 bistable (dual coil)
JP1-JP4 = EEZ_Lib1:JUMPER-2PIN
JP5 JP6 = EEZ_Lib1:JP3-CUT
L1-L4 = EEZ_Lib1:FERRITE_BEAD: FAIR-RITE - 2506033007Y3 - FERRITE BEAD, 0.04OHM, 3A, 0603 Farnell: 2112873
OK1-OK4 = EEZ_DIB:VOR1142B4
Q1-Q4 = EEZ_Lib1:BSP129: N-channel depletion mode MOSFET
Q5-Q8 = EEZ_Lib1:2N7002: N-CHANNEL ENHANCEMENT MODE FIELD EFFECT TRANSISTOR; MPN: 2N7002-7-F; OC_FARNELL: 1713823; OC_NEWARK: 25R5679; PACKAGE: SOT-23-3; SUPPLIER: DIODES INC.
R1-R32 R34 R35 R37-R42 R44 R45 R47-R54 = rcl:R-EU_: RESISTOR, European symbol
R33 R36 R43 R46 = EEZ_Lib1:R-EU_4WIRE
S1 = EEZ_DIB:211873: 2-pcs shield frame
TVS1 TVS2 = EEZ_Lib1:PESDXL1BA: Low capacitance bidirectional ESD protection diodes
X1 = EEZ_connectors:691322310008: WR-TBL Serie 322 - 3.81mm Vertical PCB Header, 8 Pins
X2 X3 = EEZ_connectors:TSW-114-07-F-D: Samtec TSW Header, 2.54MM, THT, 28-way
XO1 = EEZ_DIB:XLH
ZD1 = EEZ_Lib1:ZENER-DIODE

## Net classes
0 default: width 0.152 mm, drill 0.3 mm, clearance 0.152 mm
1 lvds: width 0.152 mm, drill 0.3 mm, clearance 0.152 mm to class 0, clearance 0.152 mm
2 gnd: width 0.254 mm, drill 0.584 mm, clearance 0.254 mm
3 diff_in: width 0.254 mm, drill 0.584 mm, clearance 0.203 mm to class 0, clearance 0.203 mm to class 1, clearance 0.203 mm to class 2, clearance 0.203 mm